# EAGLE design BeatleCalc (EAGLE 9.2.0)
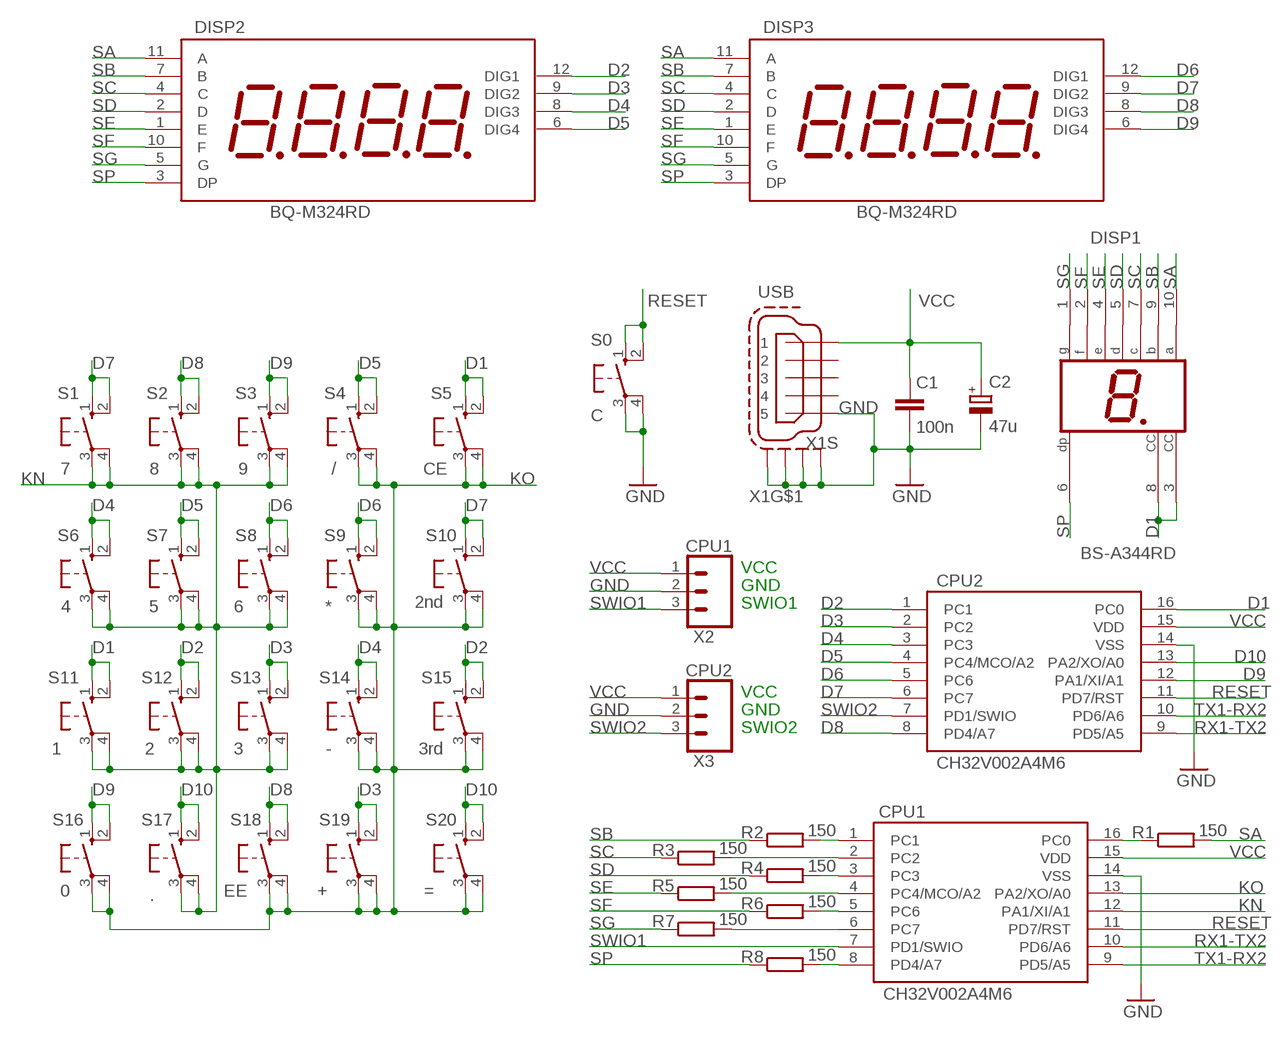
[diagram p0: schematic, sheet 1]

## Parts
C1  100n  C-EU050-024X044  [C050-024X044]
C2  47u  CPOL-EUTT2D6L  [TT2D6L]
CPU1  CH32V002A4M6  [SOP16]
CPU2  CH32V002A4M6  [SOP16]
DISP1  BS-A344RD  SC39-11SRWA  [HDSP-E]
DISP2  BQ-M324RD  4DIG_7SEG_92MM  [4DIG_7SEG_92MM]
DISP3  BQ-M324RD  4DIG_7SEG_92MM  [4DIG_7SEG_92MM]
R1  150  R-EU_0204/10  [0204/10]
R2  150  R-EU_0204/10  [0204/10]
R3  150  R-EU_0204/10  [0204/10]
R4  150  R-EU_0204/10  [0204/10]
R5  150  R-EU_0204/10  [0204/10]
R6  150  R-EU_0204/10  [0204/10]
R7  150  R-EU_0204/10  [0204/10]
R8  150  R-EU_0204/10  [0204/10]
S0  C  10-XX  [B3F-10XX]
S1  7  10-XX  [B3F-10XX]
S2  8  10-XX  [B3F-10XX]
S3  9  10-XX  [B3F-10XX]
S4  /  10-XX  [B3F-10XX]
S5  CE  10-XX  [B3F-10XX]
S6  4  10-XX  [B3F-10XX]
S7  5  10-XX  [B3F-10XX]
S8  6  10-XX  [B3F-10XX]
S9  *  10-XX  [B3F-10XX]
S10  2nd  10-XX  [B3F-10XX]
S11  1  10-XX  [B3F-10XX]
S12  2  10-XX  [B3F-10XX]
S13  3  10-XX  [B3F-10XX]
S14  -  10-XX  [B3F-10XX]
S15  3rd  10-XX  [B3F-10XX]
S16  0  10-XX  [B3F-10XX]
S17  .  10-XX  [B3F-10XX]
S18  EE  10-XX  [B3F-10XX]
S19  +  10-XX  [B3F-10XX]
S20  =  10-XX  [B3F-10XX]
X1  USB  MINI-USB-SCHIELD-32005-201  [32005-201]
X2  CPU1  CONN_03LONGPADS  [1X03_LONGPADS]
X3  CPU2  CONN_03LONGPADS  [1X03_LONGPADS]

## Nets
D1: CPU2.16(PC0) DISP1.3(CC) DISP1.8(CC) S5.1(S) S5.2(S1) S11.1(S) S11.2(S1)
D2: CPU2.1(PC1) DISP2.12(DIG1) S12.1(S) S12.2(S1) S15.1(S) S15.2(S1)
D3: CPU2.2(PC2) DISP2.9(DIG2) S13.1(S) S13.2(S1) S19.1(S) S19.2(S1)
D4: CPU2.3(PC3) DISP2.8(DIG3) S6.1(S) S6.2(S1) S14.1(S) S14.2(S1)
D5: CPU2.4(PC4/MCO/A2) DISP2.6(DIG4) S4.1(S) S4.2(S1) S7.1(S) S7.2(S1)
D6: CPU2.5(PC6) DISP3.12(DIG1) S8.1(S) S8.2(S1) S9.1(S) S9.2(S1)
D7: CPU2.6(PC7) DISP3.9(DIG2) S1.1(S) S1.2(S1) S10.1(S) S10.2(S1)
D8: CPU2.8(PD4/A7) DISP3.8(DIG3) S2.1(S) S2.2(S1) S18.1(S) S18.2(S1)
D9: CPU2.12(PA1/XI/A1) DISP3.6(DIG4) S3.1(S) S3.2(S1) S16.1(S) S16.2(S1)
D10: CPU2.13(PA2/XO/A0) S17.1(S) S17.2(S1) S20.1(S) S20.2(S1)
GND: C1.2 C2.- CPU1.14(VSS) CPU2.14(VSS) S0.3(P) S0.4(P1) X1.5 X1.M1(S:S1) X1.M2(S:S2) X1.M3(S:S3) X1.M4(S:S4) X2.2 X3.2
KN: CPU1.12(PA1/XI/A1) S1.3(P) S1.4(P1) S2.3(P) S2.4(P1) S3.3(P) S3.4(P1) S6.3(P) S6.4(P1) S7.3(P) S7.4(P1) S8.3(P) S8.4(P1) S11.3(P) S11.4(P1) S12.3(P) S12.4(P1) S13.3(P) S13.4(P1) S17.3(P) S17.4(P1)
KO: CPU1.13(PA2/XO/A0) S4.3(P) S4.4(P1) S5.3(P) S5.4(P1) S9.3(P) S9.4(P1) S10.3(P) S10.4(P1) S14.3(P) S14.4(P1) S15.3(P) S15.4(P1) S16.3(P) S16.4(P1) S18.3(P) S18.4(P1) S19.3(P) S19.4(P1) S20.3(P) S20.4(P1)
N$8: CPU1.1(PC1) R2.2
N$9: CPU1.2(PC2) R3.2
N$10: CPU1.3(PC3) R4.2
N$11: CPU1.4(PC4/MCO/A2) R5.2
N$14: CPU1.5(PC6) R6.2
N$15: CPU1.6(PC7) R7.2
N$16: CPU1.8(PD4/A7) R8.2
N$17: CPU1.16(PC0) R1.1
RESET: CPU1.11(PD7/RST) CPU2.11(PD7/RST) S0.1(S) S0.2(S1)
RX1-TX2: CPU1.10(PD6/A6) CPU2.9(PD5/A5)
SA: DISP1.10(A) DISP2.11(A) DISP3.11(A) R1.2
SB: DISP1.9(B) DISP2.7(B) DISP3.7(B) R2.1
SC: DISP1.7(C) DISP2.4(C) DISP3.4(C) R3.1
SD: DISP1.5(D) DISP2.2(D) DISP3.2(D) R4.1
SE: DISP1.4(E) DISP2.1(E) DISP3.1(E) R5.1
SF: DISP1.2(F) DISP2.10(F) DISP3.10(F) R6.1
SG: DISP1.1(G) DISP2.5(G) DISP3.5(G) R7.1
SP: DISP1.6(DP) DISP2.3(DP) DISP3.3(DP) R8.1
SWIO1: CPU1.7(PD1/SWIO) X2.3
SWIO2: CPU2.7(PD1/SWIO) X3.3
TX1-RX2: CPU1.9(PD5/A5) CPU2.10(PD6/A6)
VCC: C1.1 C2.+ CPU1.15(VDD) CPU2.15(VDD) X1.1 X2.1 X3.1
Unconnected: X1.2 X1.3 X1.4

## Notes on the sheet
- VCC
- GND
- SWIO1
- VCC
- GND
- SWIO2

## Library data of the parts
C1 = rcl:C-EU: CAPACITOR, European symbol; SPICEPREFIX: C
C2 = rcl:CPOL-EU: POLARIZED CAPACITOR, European symbol; SPICEPREFIX: C
CPU1 CPU2 = CH32V:CH32V002A4M6
DISP1 = display-hp:SC39-11SRWA: SINGLE DIGIT NUMERIC DISPLAY 9.9mm (0.39INCH) Source: SC39-11SRWA.pdf; OC_FARNELL: unknown; OC_NEWARK: unknown
DISP2 DISP3 = 7-seg-disp:4DIG_7SEG_92MM
R1-R8 = rcl:R-EU_: RESISTOR, European symbol
S0 S1-S20 = switch-omron:10-XX: OMRON SWITCH; MPN: B3F-1000; OC_FARNELL: 176432; OC_NEWARK: 36M3542
X1 = con-cypressindustries:MINI-USB-SCHIELD-: MINI USB-B Conector Source: www.cypressindustries.com; OC_FARNELL: unknown; OC_NEWARK: unknown
X2 X3 = SparkFun-Connectors:CONN_03: Multi connection point. Often used as Generic Header-pin footprint for 0.1 inch spaced/style header connections On any of the 0.1 inch spaced packages, you can populate with these: Break Away Headers - Straight <https://www.sparkfun.com/products/116> (PRT-00116) Break Away Male Headers - Right Angle <https://www.sparkfun.com/products/553> (PRT-00553) Female Headers <https://www.sparkfun.com/products/115> (PRT-00115) Break Away Headers - Machine Pin <https://www.sparkfun.com/products/117> (PRT-00117) Break Away Female Headers - Swiss Machine Pin <https://www.sparkfun.com/products/743> (PRT-00743) Stackable Header - 3 Pin (Female, 0.1") <https://www.sparkfun.com/products/13875> (PRT-13875) For SCREWTERMINALS and SPRING TERMINALS visit here: Screw Terimnals on SparkFun.com <https://www.sparkfun.com/search/results?term=Screw+Terminals> (5mm/3.5mm/2.54mm spacing) This device is also useful as a general connection point to wire up your design to another part of your project. Our various solder wires solder well into these plated through hole pads. Hook-Up Wire - Assortment (Stranded, 22 AWG) <https://www.sparkfun.com/products/11375> (PRT-11375) Hook-Up Wire - Assortment (Solid Core, 22 AWG) <https://www.sparkfun.com/products/11367> (PRT-11367) View the entire wire category on our website here <https://www.sparkfun.com/categories/141> Special notes: Molex polarized connector foot print use with SKU : PRT-08232 with associated crimp pins and housings.

## Board
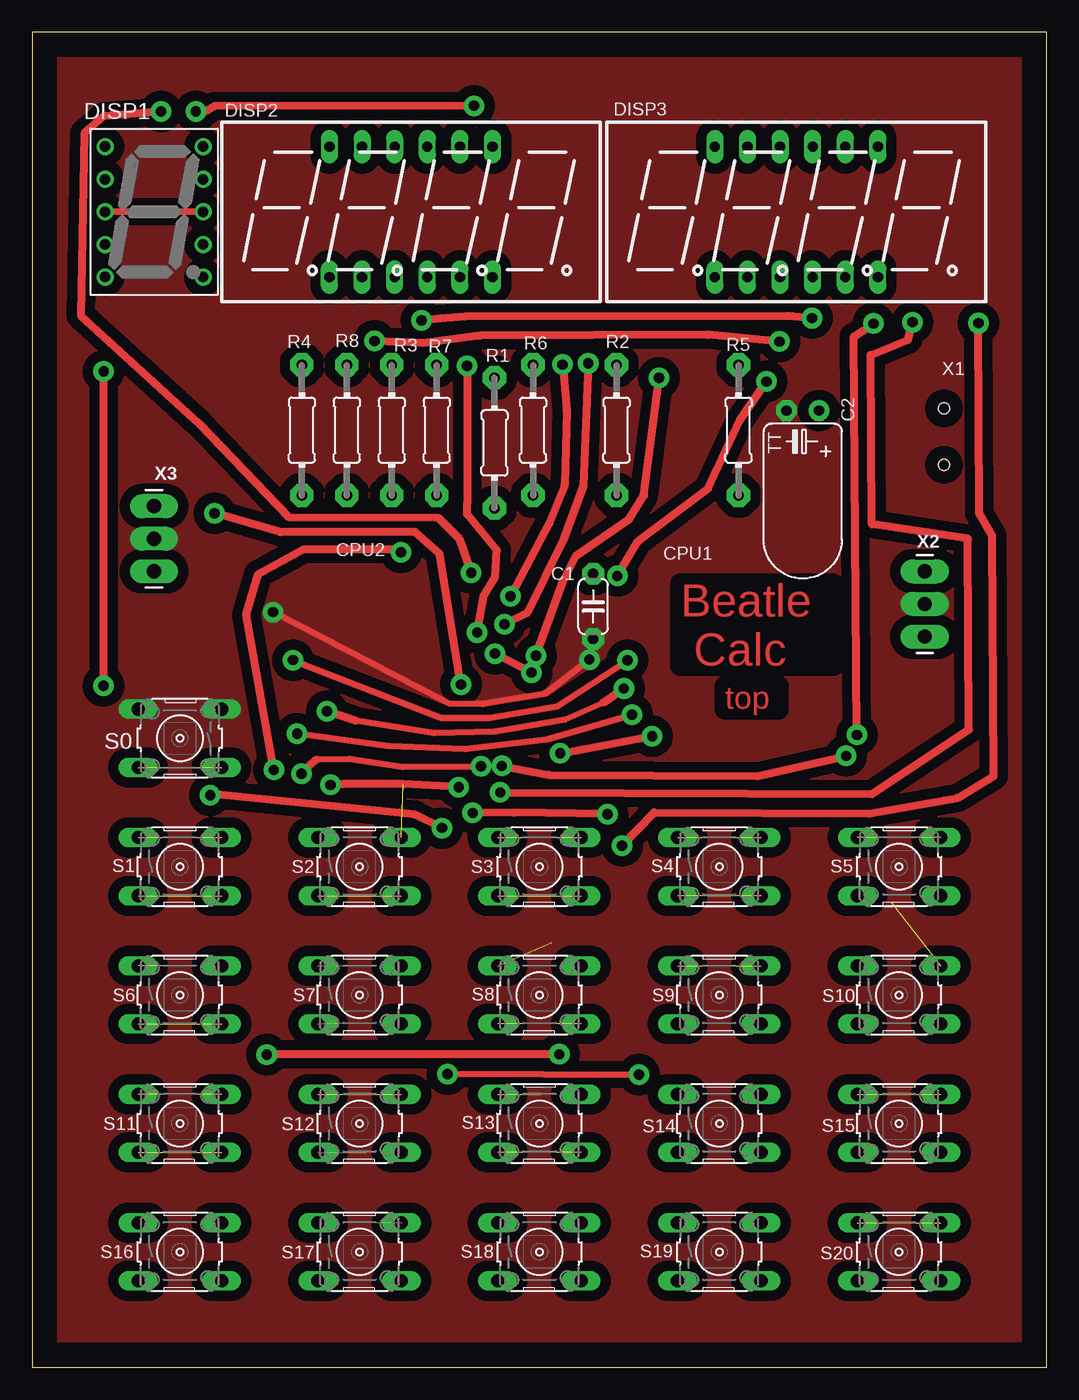
[diagram p1: board, top side]
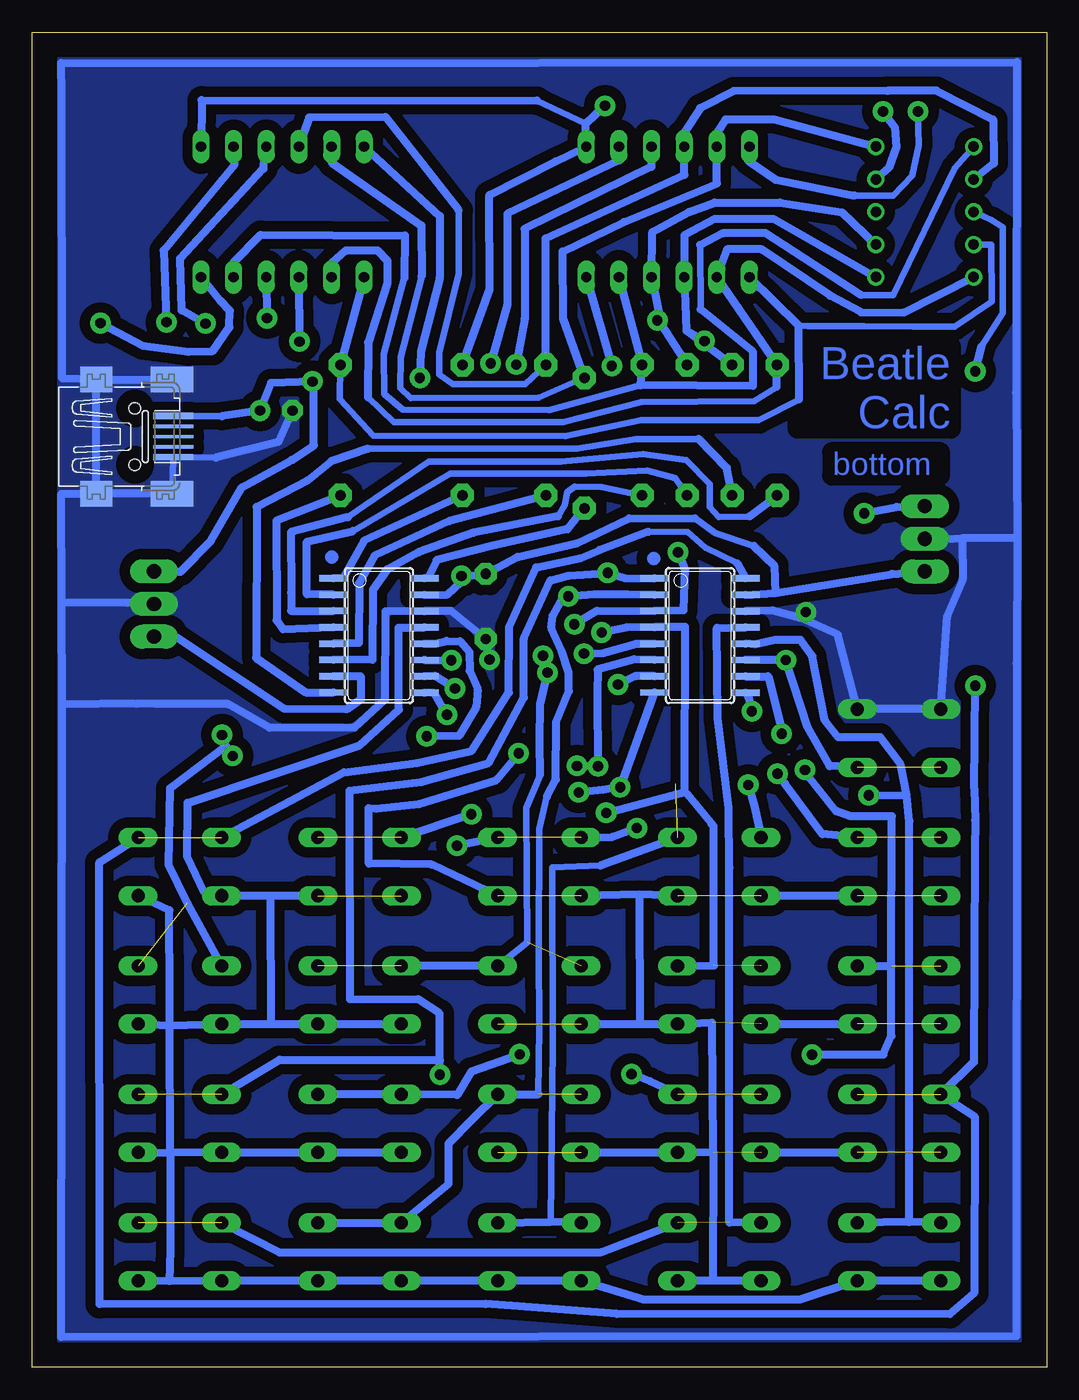
[diagram p2: board, bottom side, seen from below]

Size 79 x 104 mm. Coordinates in mm from the lower left corner, seen from the top.
Outline: 0,0 79,0 79,104 0,104 0,0
Copper layers (1*16): Top 0.035mm / dielectric 1.5mm / Bottom 0.035mm
Design rules "default": minimum track width 6mil, minimum drill 0.35mm, track to track 6mil, track to pad 6mil, pad to pad 6mil, via to via 6mil, smd to smd 6mil, copper to edge 40mil, drill to drill 6mil, minimum pad ring 10mil, minimum via ring 8mil, stop-mask expansion 4mil, vias tented up to drill 0mil, thermal gap 10mil

### Footprints (pad centres in the part's own frame; a part is rotated, then mirrored left to right if it is on the bottom)
C050-024X044 = drill 0.813 pad 1.7 octagon: 1 -2.54,0; 2 2.54,0
TT2D6L = drill 0.813 pad 1.6: + -1.27,0 | drill 0.813 pad 1.6 octagon: - 1.27,0
SOP16 = smd 0.5 x 2.2: 1 -4.445,-3.55; 2 -3.185,-3.55; 3 -1.915,-3.55; 4 -0.645,-3.55; 5 0.635,-3.55; 6 1.895,-3.55; 7 3.165,-3.55; 8 4.435,-3.55; 9 4.445,3.55; 10 3.175,3.55; 11 1.905,3.55; 12 0.635,3.55; 13 -0.635,3.55; 14 -1.905,3.55; 15 -3.175,3.55; 16 -4.445,3.55
HDSP-E = drill 0.813: 1 -3.81,5.08; 2 -3.81,2.54; 3 -3.81,0; 4 -3.81,-2.54; 5 -3.81,-5.08; 6 3.81,-5.08; 7 3.81,-2.54; 8 3.81,0; 9 3.81,2.54; 10 3.81,5.08
4DIG_7SEG_92MM = drill 0.8 long: 1 -6.35,-5.08; 2 -3.81,-5.08; 3 -1.27,-5.08; 4 1.27,-5.08; 5 3.81,-5.08; 6 6.35,-5.08; 7 6.35,5.08; 8 3.81,5.08; 9 1.27,5.08; 10 -1.27,5.08; 11 -3.81,5.08; 12 -6.35,5.08
0204/10 = drill 0.813 pad 1.8 octagon: 1 -5.08,0; 2 5.08,0
B3F-10XX = drill 1.016 long: 1 -3.251,2.261; 2 3.251,2.261; 3 -3.251,-2.261; 4 3.251,-2.261
32005-201 = smd 3.1 x 0.5: 1 3,1.6; 5 3,-1.6 | smd 3.1 x 0.254: 2 3,0.8; 3 3,0; 4 3,-0.8 | smd 2.5 x 2: M1 -3,-4.45; M2 -3,4.45 | smd 3.3 x 2: M3 2.9,4.45; M4 2.9,-4.45 | hole 0.9: 0,2.2; 0,-2.2
1X03_LONGPADS = drill 1.118 pad 1.88 long: 1 0,0; 2 2.54,0; 3 5.08,0

### Placement (x,y rotation side)
C1  43.68,59.27 270 top
C2  60,74.52 180 top
CPU1  52,57 270 bottom
CPU2  27,57 270 bottom
DISP1  9.5,90 0 top
DISP2  29.5,90 0 top
DISP3  59.5,90 0 top
R1  36,72 90 top
R2  45.5,73 270 top
R3  28,73 270 top
R4  21,73 270 top
R5  55,73 270 top
R6  39,73 270 top
R7  31.5,73 270 top
R8  24.5,73 270 top
S0  11.5,49 180 top
S1  11.5,39 0 top
S2  25.5,39 0 top
S3  39.5,39 0 top
S4  53.5,39 0 top
S5  67.5,39 0 top
S6  11.5,29 0 top
S7  25.5,29 0 top
S8  39.5,29 0 top
S9  53.5,29 0 top
S10  67.5,29 0 top
S11  11.5,19 0 top
S12  25.5,19 0 top
S13  39.5,19 0 top
S14  53.5,19 0 top
S15  67.5,19 0 top
S16  11.5,9 0 top
S17  25.5,9 0 top
S18  39.5,9 0 top
S19  53.5,9 0 top
S20  67.5,9 0 top
X1  71,72.5 0 bottom
X2  69.5,62 270 top
X3  9.5,62 90 top

### Tracks (layer width: path | path; a pad name or v marks a point on that pad's centre or on a via)
D1  (via drill 0.8 pad 1.6)  (2 unrouted)
  Top 0.508: DISP1.3 DISP1.8
  Top 0.61: v5.57,53.09 v5.57,77.58
  Bottom 0.508: 31.03,65.09 27.95,65.06 26.6,63.84 24.11,62.64 | 5.08,79.54 3.43,82.09 3.44,88.79 4.3,89.36 4.94,89.67 DISP1.3
  Bottom 0.61: S5.1 54.73,46.35 49.06,47.08 44.79,48.03 41.88,52.55 41.86,57.65 39.75,62.3 36.29,63.02 34.82,63.67 31.03,65.09 | 24.11,62.64 CPU2.16 | S5.2 73.77,39.34 73.74,4.92 43.7,4.95 33.47,4.17 7.54,4.14 5.66,5.79 5.63,19.54 S11.1 5.68,23.8 5.6,40.3 5.58,42.6 5.63,45.04 v5.57,53.09 | v5.57,77.58 5.08,79.54
D2  (via drill 0.8 pad 1.6)  (2 unrouted)
  Top 0.508: v32.33,22.84 v47.26,22.8
  Top 0.61: v34.18,61.88 33.24,64.55 31.61,66.18 19.98,66.24 13,73.51 3.79,81.93 4.06,96.12 5.56,97.45 v10.03,97.81
  Bottom 0.508: 14.99,91.27 11.94,91.26 10.47,92.82 9.98,95.19 v10.03,97.81
  Bottom 0.61: S12.2 30.9,22.28 v32.33,22.84 | v47.26,22.8 47.26,23.95 | 47.26,23.95 47.27,27.57 48.95,28.67 54.25,28.7 54.27,44.92 48.74,45.58 43.46,47.08 40.72,52.16 40.71,56.78 38.66,61.3 37.24,61.67 v34.18,61.88 32.82,61.47 CPU2.1 | DISP2.12 23.2,93.95 21.11,92.49 14.99,91.27 | S15.1 59.74,23.97 47.26,23.95
D3  (via drill 0.8 pad 1.6)  (1 unrouted)
  Top 0.61: v41.3,78.11 41.61,74.48 41.46,68.73 40.27,65.74 v37.25,60.07
  Bottom 0.508: 39.59,21.27 39.53,26.47 39.56,32.38 39.52,41.94 38.93,44.45
  Bottom 0.61: 39.59,21.27 S13.2 44.79,19.27 46.56,17.44 46.56,14.32 S19.1 S19.2 | DISP2.9 30.78,93.51 40.65,88.67 40.65,81.67 v41.3,78.11 | CPU2.2 32.67,60.22 35.23,60.23 v37.25,60.07 37.6,60.06 38.48,58.53 38.57,57.57 37.78,55.79 37.23,54.11 37.22,52.65 38.21,50.25 38.22,45.77 38.93,44.45
D4  (via drill 0.8 pad 1.6)  (1 unrouted)
  Top 0.61: v41.04,24.39 v18.27,24.37 | v43.3,78.2 42.89,68.66 41.37,64.43 38.54,58.77 v36.78,57.88 | v18.82,46.54 16.68,58.62 17.62,61.78 21.16,63.72 28.07,63.72 v28.71,63.49
  Bottom 0.61: S6.2 12.11,31.27 | 12.11,31.27 12.06,42.92 15.25,42.92 16.43,43.33 18.68,46.18 v18.82,46.54 | v41.04,24.39 44.79,23.05 45.91,21.22 S14.1 S14.2 | v18.27,24.37 12.73,24.36 12.1,25.81 12.12,27.09 12.11,31.27 | DISP2.8 33.25,94.01 41.99,89.85 42,82.79 v43.3,78.2 | v36.78,57.88 35.03,58.93 CPU2.3 28.3,58.95 28.2,62.23 v28.71,63.49
D5  (via drill 0.8 pad 1.6)  (2 unrouted)
  Top 0.61: v33.87,78 33.86,67.24 33.87,66.46 36.19,63.65 36.06,61.57 35.16,60.09 v34.65,57.24 | v44.8,43.09 37.5,43.22 v34.3,43.19
  Bottom 0.61: S4.1 v44.8,43.09 | S7.2 25.93,31.3 25.95,42.15 | 25.95,42.15 26.11,42.33 | 25.95,42.15 27.94,44.62 28.18,44.82 | 28.18,44.82 28.16,57.68 CPU2.4 32.68,57.63 v34.65,57.24 | DISP2.6 v33.87,78 | v34.3,43.19 28.18,44.82
D6  (via drill 0.8 pad 1.6)  (2 unrouted)
  Top 0.61: v39.22,55.42 41.31,61.19 42.34,63.21 46.5,66.09 47.63,67.9 v48.81,77.08 | v38.87,54.11 v36.04,55.59
  Bottom 0.508: S8.2 40.47,33.12 40.52,43.58 39.45,46.16
  Bottom 0.61: S8.2 S9.1 | v36.04,55.59 34.56,55.63 31.94,56.37 CPU2.5 | DISP3.12 47.26,89.67 47.27,84.84 48.73,79.11 v48.81,77.08 | 39.45,46.16 39.49,48.75 39.45,51.63 v38.87,54.11 39.06,54.77 v39.22,55.42
D7  (via drill 0.8 pad 1.6)  (2 unrouted)
  Top 0.508: v34.94,46.82 28.84,46.75 24.73,47.38 22.12,47.34
  Top 0.61: 22.12,47.34 v20.97,46.24 | v36.57,46.85 40.24,46.14 56.49,46.06 v63.38,47.63 | v64.22,49.26 63.97,80.29 v65.51,81.3
  Bottom 0.61: S1.2 17.48,41.53 20.4,45.5 v20.97,46.24 | 63.9,48.4 68.25,45.1 68.36,39.15 66.91,36.17 S10.1 | CPU2.6 32.12,55.14 34.97,54.34 35,52.47 v34.94,46.82 v36.57,46.85 | v63.38,47.63 63.9,48.4 | 63.9,48.4 v64.22,49.26 | v65.51,81.3 67.35,82.33 67.47,86.36 61,93.36 DISP3.9
D8  (via drill 0.8 pad 1.6)  (1 unrouted)
  Top 0.61: v33.21,45.19 28.9,45.43 24.21,45.44 v23.24,45.37 | v36.44,44.78 65.39,44.65 72.94,49.67 72.85,64.55 65.38,65.67 65.29,78.86 68.21,80.04 v68.54,81.41
  Bottom 0.508: 38.63,11.34 38.46,25.14 38.49,38.96 34.73,39.08
  Bottom 0.61: S2.1 22.77,43.72 v23.24,45.37 | S18.1 38.63,11.34 S18.2 | S2.2 34.73,39.08 | CPU2.8 v33.21,45.19 34.54,44.98 v36.44,44.78 | DISP3.8 63.28,93.62 68.77,86.98 v68.54,81.41
D9  (via drill 0.8 pad 1.6)  (1 unrouted)
  Top 0.61: v31.92,42.01 29.78,43.05 13.97,44.68 v13.86,44.57 | v45.92,40.63 48.42,43.23 65.19,43.14 72.05,44.37 74.86,46.05 74.75,64.8 73.73,66.53 v73.68,81.33
  Bottom 0.61: S3.1 33.8,41.32 v31.92,42.01 | S16.1 10.71,11.33 | 10.71,11.33 10.69,42.53 10.91,44.55 | 10.91,44.55 11.38,46.95 12.96,49.06 16.22,49.08 17.29,50.4 18.25,55.38 19.19,56.66 21.12,56.67 22.71,56.31 CPU2.12 | 10.71,11.33 S16.2 | DISP3.6 64.42,83.14 63.61,82.31 63.63,81.02 64.92,79.17 66.82,79.1 70.38,79.58 v73.68,81.33 | v13.86,44.57 10.91,44.55 | S3.2 v45.92,40.63
D10  (2 unrouted)
  Bottom 0.61: S17.1 24.72,11.29 24.71,38.91 24.77,43.56 25.62,50.58 25.69,57.59 CPU2.13 | S20.1 59.73,8.95 34.68,8.98 S17.2
GND  (via drill 0.8 pad 1.6)
  Top 0.508: v43.38,55.13 39.99,52.48 35.03,51.66 32.47,51.69 19.23,58.6
  Top 0.61: 19.23,58.6 v18.76,58.83
  Bottom 0.508: 64.69,70.86 X1.5 X1.M4
  Bottom 0.61: CPU2.14 21.37,58.95 19.07,58.34 | 19.07,58.34 16.26,57.06 S0.3 S0.4 7.74,58.54 6.54,61.34 6.57,64.59 | 6.57,64.59 7.84,64.51 X3.2 | C2.- 59.82,72.07 64.69,70.86 | X1.M4 X1.M1 | X1.M1 X1.M2 | X1.M2 X1.M3 | X1.M2 76.65,77.02 76.71,99.08 76.74,101.59 2.34,101.66 2.38,75.9 2.3,64.59 | 2.3,64.59 6.57,64.59 | 2.3,64.59 2.34,54.83 2.36,2.43 76.74,2.37 76.65,51.65 | 76.65,51.65 76.67,59.54 | 76.67,59.54 76.72,68.05 X1.M1 | v43.38,55.13 43.52,55.09 C1.2 46.37,58.91 CPU1.14 51.5,58.87 51.53,51.99 53.9,49.8 60.54,49.83 63.74,51.66 69.38,51.67 70.86,51.7 76.65,51.65 | v18.76,58.83 19.07,58.34 | X2.2 71.57,59.56 76.67,59.54
  pour Bottom (isolate 0.813, no thermals): 2,2 2,102 77,102 77,2
  pour Top (isolate 0.813, no thermals): 2,2 77,2 77,102 2,102
KN  (via drill 0.8 pad 1.6)  (9 unrouted)
  Top 0.61: v41.12,47.83 v48.27,49.17
  Bottom 0.61: S17.3 25.99,6.75 | 25.99,6.75 S17.4 | 25.96,16.71 S12.4 S13.3 | 25.96,16.71 25.99,6.75 | S12.3 S11.4 | S8.3 31.67,26.75 | 31.67,26.75 S7.4 26.05,26.86 25.96,16.71 | S7.3 S6.4 | S1.4 S2.3 | S2.4 31.7,36.82 | 31.7,36.82 S3.3 | S3.4 47.89,39.17 52.79,39.24 52.8,43.55 52.17,43.52 48.91,43.87 42.84,45.76 v41.12,47.83 | 31.67,26.75 31.7,36.82 | CPU1.12 47.59,56.37 46.75,56.58 45.68,56.55 44.95,55.7 44.93,54.24 44.32,52.82 44.44,51.45 45.76,49.21 v48.27,49.17
KO  (1 unrouted)
  Bottom 0.61: S16.3 S16.4 19.23,5.28 31.39,5.27 S18.3 S18.4 S19.3 S19.4 S20.3 68.31,6.72 | 68.31,6.72 S20.4 | S15.4 68.25,16.72 | 68.25,16.72 68.24,9.14 68.31,6.72 | S10.4 68.28,26.63 | 60.41,26.74 S10.3 68.28,26.63 | 60.41,26.74 S9.4 S9.3 | 68.25,16.72 68.28,26.63 | S4.4 60.45,36.74 | 60.45,36.74 S5.3 65.59,37.01 66.93,39.81 66.89,43.97 53.54,48.43 50.45,51.22 50.47,57.61 CPU1.13 | S5.4 68.32,35.6 68.29,28.88 68.28,26.63 | S14.3 S14.4 S15.3 68.25,16.72 | 60.45,36.74 60.41,26.74
N$8
  Bottom 0.61: R2.2 53.15,64.4 54.78,61.49 CPU1.1
N$9
  Bottom 0.508: 54,65.15 46.44,69.61 35.88,69.63 31.09,69.84 28.92,69.25 R3.2
  Bottom 0.61: CPU1.2 57.62,60.23 57.62,64.32 54,65.15
N$10
  Bottom 0.508: 23.15,66.28 25.56,66.24 26.25,67.01 26.23,68.81 28.06,70.68 31.41,71.14 37.85,70.54 48.14,70.57 54.41,66.21
  Bottom 0.61: R4.2 23.15,66.28 | 54.41,66.21 58.85,65.06 58.83,60.31 58.83,58.92 CPU1.3
N$11
  Bottom 0.61: R5.2 59.99,65.94 59.97,58.19 59.46,57.49 CPU1.4
N$14
  Bottom 0.61: R6.2 46.54,65.91 52.33,63.23 53.54,61.07 53.56,56.44 CPU1.5
N$15
  Bottom 0.508: R7.2 34.67,68.57 36.75,68.61 37.34,68.17 37.52,67.16 38.05,66.29
  Bottom 0.61: 38.05,66.29 44.62,65.01 48.88,63.5 51.37,62.15 52.48,60.55 52.52,55.12 CPU1.6
N$16
  Bottom 0.508: 27.1,72.31 31.99,72.31 36.57,71.57 52.85,71.54
  Bottom 0.61: R8.2 24.91,70.06 27.1,72.31 | 52.85,71.54 55.67,70.6 57.54,69.07 61.53,67.01 61.56,55.26 57.69,52.58 CPU1.8
N$17
  Bottom 0.61: R1.1 37.3,65.28 43.09,64.02 47.5,62.87 48.13,61.58 CPU1.16
RESET  (via drill 0.8 pad 1.6)  (1 unrouted)
  Top 0.508: v46.36,55.07 40.88,51.48 35.6,50.57 31.84,50.56 20.49,54.96
  Top 0.61: 20.49,54.96 v20.32,55.09
  Bottom 0.61: S0.1 16.9,46.84 18.61,49.83 20.34,55.08 | 20.34,55.08 CPU2.11 | CPU1.11 v46.36,55.07 | v20.32,55.09 20.34,55.08
RX1-TX2  (via drill 0.8 pad 1.6)
  Top 0.508: 25.2,50.38 31.3,49.41 36.06,49.53 41.53,50.45 44.49,51.8
  Top 0.61: v22.96,51.11 25.2,50.38 | 44.49,51.8 v46.07,52.88
  Bottom 0.61: CPU2.9 23.22,52.14 v22.96,51.11 | v46.07,52.88 47.65,53.86 CPU1.10
SA
  Bottom 0.508: 48.68,84.96 50.31,78.68 50.35,76.26 49.5,75.48 39.56,75.52 R1.2
  Bottom 0.61: R1.2 37.66,81.67 37.7,86.9 32.93,89.2 25.69,92.2 DISP2.11 25.64,96.22 25.01,97.2 21.23,97.2 DISP1.10 | DISP3.11 55.64,93.8 48.7,88.92 48.68,84.96
SB  (via drill 0.8 pad 1.6)
  Top 0.61: v34.4,98.26 14.22,98.23 13.54,97.86 v12.74,97.81
  Bottom 0.508: 39.69,98.67 35.89,96.85
  Bottom 0.61: R2.1 43.38,83.98 43.4,91.3 38.25,93.92 DISP2.7 35.89,96.85 v34.4,98.26 | 39.69,98.67 65.81,98.7 DISP3.7 | v12.74,97.81 11.84,96.61 11.71,95.02 12.32,93.41 DISP1.9
SC  (via drill 0.8 pad 1.6)
  Top 0.61: v60.72,81.72 58.81,81.89 33.72,81.84 31.78,81.7 v30.33,81.54
  Bottom 0.61: 30.04,81.22 DISP2.4 30.71,88.43 27.87,89.99 25.86,90.73 20.77,90.72 15.95,89.97 DISP1.7 | 30.04,81.22 R3.1 | DISP3.4 v60.72,81.72 | v30.33,81.54 30.04,81.22
SD
  Bottom 0.508: 52.85,75.55 50.86,73.62 37.65,73.63 31.58,75.2 22.79,75.24 21.03,76.37
  Bottom 0.61: DISP3.2 55.66,86.03 54.57,87.01 52.12,87.01 51.35,86.19 51.34,84.45 52.85,79.82 52.85,75.55 | 21.03,76.37 R4.1 DISP2.2 24.88,87.08 22.22,87.09 16.87,83.47 14.45,82.18 11.12,82.16 DISP1.5
SE
  Bottom 0.508: 19.3,81.12 18.59,81.11 14.24,81.08 10.39,81.08 7.17,81.08 4.29,83 4.33,87.44 DISP1.4 | R5.1 55.05,75.41 52.44,72.56 37.48,72.53 31.55,73.78 22.44,73.78 19.28,75.39
  Bottom 0.61: DISP2.1 19.3,81.12 19.28,75.39 | DISP3.1 R5.1
SF
  Bottom 0.508: R6.1 40.59,76.59 46.26,76.59 47.31,77.33 47.31,79.05 45.77,85.19 45.79,90.11
  Bottom 0.61: R6.1 39.01,87.94 28.21,92.89 DISP2.10 28.18,95.46 28.18,96.26 27,98.08 24.38,99.41 12.41,99.42 8.59,99.45 4.17,97.19 4.12,93.78 DISP1.2 | 45.79,90.11 51.48,97.38 57.44,97.35 DISP3.10
SG
  Bottom 0.508: 14.47,83.52 11.96,83.5 7.16,93.42 DISP1.1 | 26.99,87.42 26.95,82.42 | 50.03,84.87 51.62,78.91 51.58,75.8 50.12,74.58 38.73,74.57 31.62,76.49
  Bottom 0.61: 14.47,83.52 21.94,88.35 25.22,88.32 26.99,87.42 | 26.95,82.42 22.9,79.14 22.88,76.44 31.62,76.49 R7.1 DISP2.5 | DISP3.5 63.3,86.09 61.2,88.22 49.99,88.16 50.03,84.87
SP  (via drill 0.8 pad 1.6)
  Top 0.61: v58.19,79.9 52.62,80.43 34.85,80.35 30.45,79.78 v26.65,79.94
  Bottom 0.61: 28.06,80.73 DISP2.3 28.22,88.17 25.83,89.45 21.32,89.45 DISP1.6 | 28.06,80.73 R8.1 | DISP3.3 v58.19,79.9 | v26.65,79.94 28.06,80.73
SWIO1
  Bottom 0.61: CPU1.7 53.42,53.84 53.41,52.02 54.51,51.25 59.35,51.29 67.7,56.81 X2.3
SWIO2  (via drill 0.8 pad 1.6)
  Top 0.61: v33.38,53.19 31.73,63.36 29.81,65.07 19.34,65.05 v14.21,66.52
  Bottom 0.61: CPU2.7 32.03,53.84 v33.38,53.19 | v14.21,66.52 11.71,67.02 X3.3
TX1-RX2  (via drill 0.8 pad 1.6)
  Top 0.508: v20.64,49.35 27.73,48.42 33.74,48.18 40.06,48.92 v46.7,50.83
  Bottom 0.61: CPU2.10 21.7,53.83 20.65,49.66 v20.64,49.35 | v46.7,50.83 47.7,52.51 CPU1.9
VCC  (via drill 0.8 pad 1.6)
  Top 0.61: v45.56,61.64 47.17,64.31 52.61,68.41 55.12,73.83 v57.17,76.78
  Bottom 0.508: 64.22,74.08 X1.1 | 27.39,66.15 25.81,65 22.8,63.99
  Bottom 0.61: CPU2.15 21.16,60.33 | 21.16,60.33 12.05,61.8 X3.1 | X2.1 67.43,61.98 65.08,64.37 62.66,68.53 58.8,70.68 57.07,71.81 57.06,76.79 | 64.22,74.08 C2.+ 60.41,76.68 57.06,76.79 | CPU1.15 46.67,60.2 45.14,61.63 | 45.14,61.63 C1.1 41.21,63.12 36.58,64.19 32.54,66.12 27.39,66.15 | 45.14,61.63 v45.56,61.64 | v57.17,76.78 57.06,76.79 | 22.8,63.99 21.24,62.45 21.16,60.33
(copper drawn outside any net)
  shapes: Bottom circle x2

### Text on the board
Top: Beatle / Calc | top
Bottom: Beatle / Calc | bottom
Document: SWIO2 | GND | VCC | VCC | GND | SWIO1